# EAGLE design peacock3 (EAGLE 6.5.0)
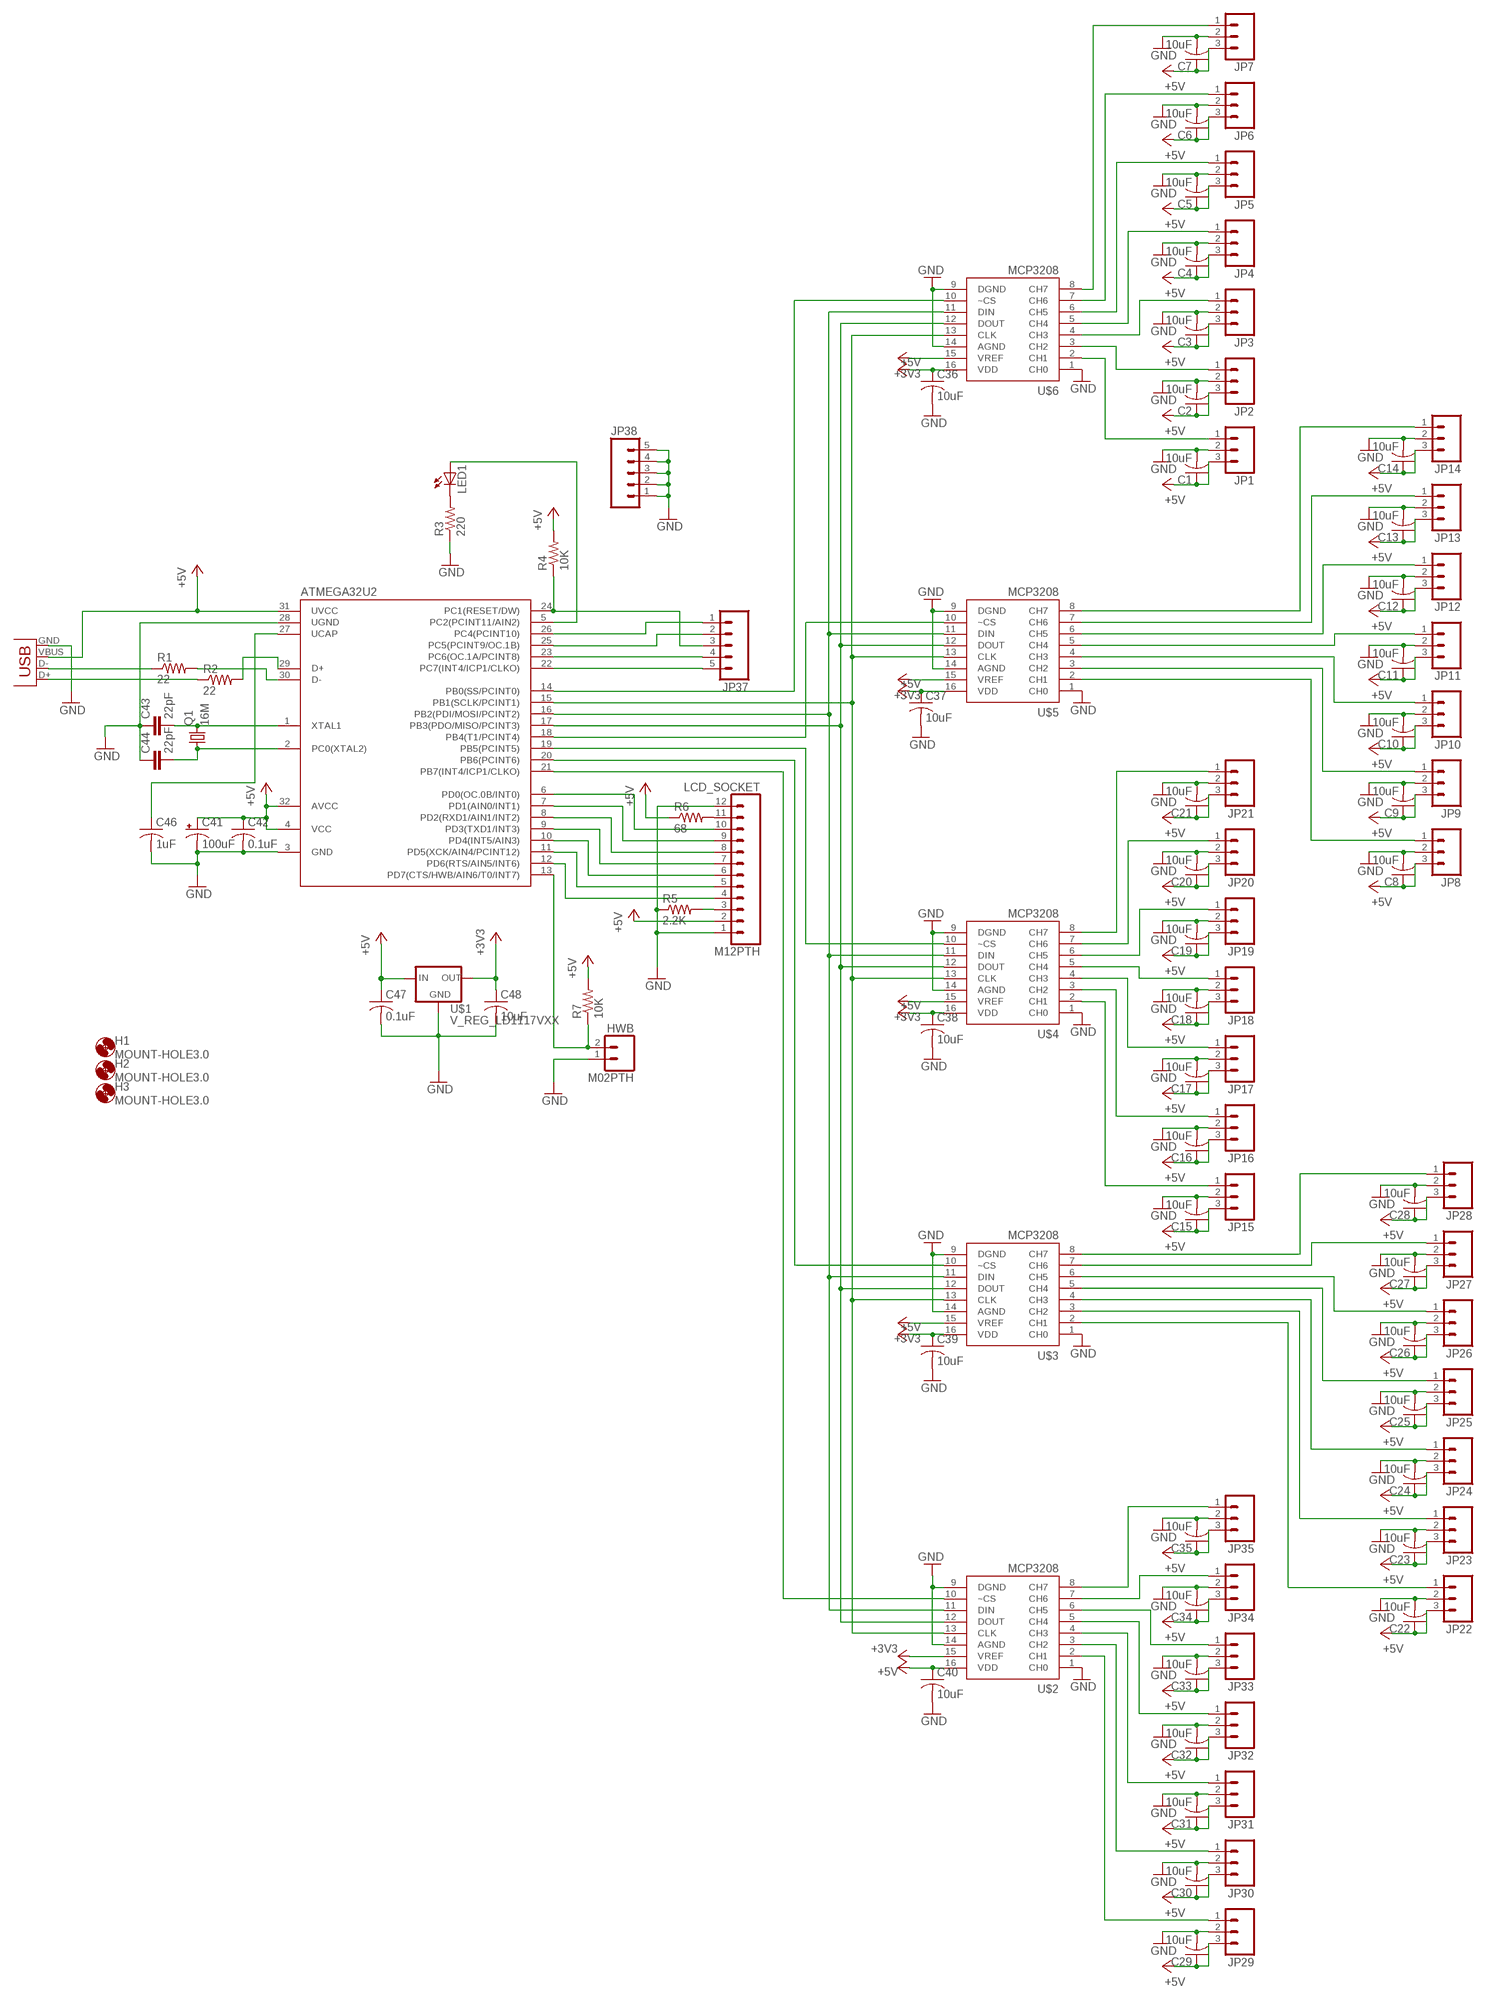
[diagram p0: schematic, sheet 1]

## Parts
ATMEGA32U2  ATMEGA32U2  [TQFP32-08]
C1  10uF  C-USC1210  [C1210]
C2  10uF  C-USC1210  [C1210]
C3  10uF  C-USC1210  [C1210]
C4  10uF  C-USC1210  [C1210]
C5  10uF  C-USC1210  [C1210]
C6  10uF  C-USC1210  [C1210]
C7  10uF  C-USC1210  [C1210]
C8  10uF  C-USC1210  [C1210]
C9  10uF  C-USC1210  [C1210]
C10  10uF  C-USC1210  [C1210]
C11  10uF  C-USC1210  [C1210]
C12  10uF  C-USC1210  [C1210]
C13  10uF  C-USC1210  [C1210]
C14  10uF  C-USC1210  [C1210]
C15  10uF  C-USC1210  [C1210]
C16  10uF  C-USC1210  [C1210]
C17  10uF  C-USC1210  [C1210]
C18  10uF  C-USC1210  [C1210]
C19  10uF  C-USC1210  [C1210]
C20  10uF  C-USC1210  [C1210]
C21  10uF  C-USC1210  [C1210]
C22  10uF  C-USC1210  [C1210]
C23  10uF  C-USC1210  [C1210]
C24  10uF  C-USC1210  [C1210]
C25  10uF  C-USC1210  [C1210]
C26  10uF  C-USC1210  [C1210]
C27  10uF  C-USC1210  [C1210]
C28  10uF  C-USC1210  [C1210]
C29  10uF  C-USC1210  [C1210]
C30  10uF  C-USC1210  [C1210]
C31  10uF  C-USC1210  [C1210]
C32  10uF  C-USC1210  [C1210]
C33  10uF  C-USC1210  [C1210]
C34  10uF  C-USC1210  [C1210]
C35  10uF  C-USC1210  [C1210]
C36  10uF  C-USC1210  [C1210]
C37  10uF  C-USC1210  [C1210]
C38  10uF  C-USC1210  [C1210]
C39  10uF  C-USC1210  [C1210]
C40  10uF  C-USC1210  [C1210]
C41  100uF  CPOL-USE5-6  [E5-6]
C42  0.1uF  C-USC1210  [C1210]
C43  22pF  C-EU050-024X044  [C050-024X044]
C44  22pF  C-EU050-024X044  [C050-024X044]
C46  1uF  C-USC1210  [C1210]
C47  0.1uF  C-USC1210  [C1210]
C48  10uF  C-USC1210  [C1210]
H1  MOUNT-HOLE3.0  [3,0]
H2  MOUNT-HOLE3.0  [3,0]
H3  MOUNT-HOLE3.0  [3,0]
HWB  M02PTH  [1X02]
JP1  M03PTH  [1X03]
JP2  M03PTH  [1X03]
JP3  M03PTH  [1X03]
JP4  M03PTH  [1X03]
JP5  M03PTH  [1X03]
JP6  M03PTH  [1X03]
JP7  M03PTH  [1X03]
JP8  M03PTH  [1X03]
JP9  M03PTH  [1X03]
JP10  M03PTH  [1X03]
JP11  M03PTH  [1X03]
JP12  M03PTH  [1X03]
JP13  M03PTH  [1X03]
JP14  M03PTH  [1X03]
JP15  M03PTH  [1X03]
JP16  M03PTH  [1X03]
JP17  M03PTH  [1X03]
JP18  M03PTH  [1X03]
JP19  M03PTH  [1X03]
JP20  M03PTH  [1X03]
JP21  M03PTH  [1X03]
JP22  M03PTH  [1X03]
JP23  M03PTH  [1X03]
JP24  M03PTH  [1X03]
JP25  M03PTH  [1X03]
JP26  M03PTH  [1X03]
JP27  M03PTH  [1X03]
JP28  M03PTH  [1X03]
JP29  M03PTH  [1X03]
JP30  M03PTH  [1X03]
JP31  M03PTH  [1X03]
JP32  M03PTH  [1X03]
JP33  M03PTH  [1X03]
JP34  M03PTH  [1X03]
JP35  M03PTH  [1X03]
JP36  USB-B  USBPTH  [USB-B-PTH]
JP37  M05PTH  [1X05]
JP38  M05PTH  [1X05]
LCD_SOCKET  M12PTH  [1X12]
LED1  LED5MM  [LED5MM]
Q1  16M  CRYSTALHC18U-V  [HC18U-V]
R1  22  R-US_0204/7  [0204/7]
R2  22  R-US_0204/7  [0204/7]
R3  220  R-US_0204/7  [0204/7]
R4  10K  R-US_0204/7  [0204/7]
R5  2.2K  R-US_0204/7  [0204/7]
R6  68  R-US_0204/7  [0204/7]
R7  10K  R-US_0204/7  [0204/7]
U$1  V_REG_LD1117VXX  [78XXL]
U$2  MCP3208  [SO16]
U$3  MCP3208  [SO16]
U$4  MCP3208  [SO16]
U$5  MCP3208  [SO16]
U$6  MCP3208  [SO16]

## Nets
+3V3: C48.1 U$1.GND(OUT) U$2.15(VREF) U$3.15(VREF) U$4.15(VREF) U$5.15(VREF) U$6.15(VREF)
+5V: ATMEGA32U2.4(VCC) ATMEGA32U2.31(UVCC) ATMEGA32U2.32(AVCC) C1.1 C2.1 C3.1 C4.1 C5.1 C6.1 C7.1 C8.1 C9.1 C10.1 C11.1 C12.1 C13.1 C14.1 C15.1 C16.1 C17.1 C18.1 C19.1 C20.1 C21.1 C22.1 C23.1 C24.1 C25.1 C26.1 C27.1 C28.1 C29.1 C30.1 C31.1 C32.1 C33.1 C34.1 C35.1 C36.1 C37.1 C38.1 C39.1 C40.1 C41.+ C42.1 C47.1 JP1.3 JP2.3 JP3.3 JP4.3 JP5.3 JP6.3 JP7.3 JP8.3 JP9.3 JP10.3 JP11.3 JP12.3 JP13.3 JP14.3 JP15.3 JP16.3 JP17.3 JP18.3 JP19.3 JP20.3 JP21.3 JP22.3 JP23.3 JP24.3 JP25.3 JP26.3 JP27.3 JP28.3 JP29.3 JP30.3 JP31.3 JP32.3 JP33.3 JP34.3 JP35.3 JP36.VBUS LCD_SOCKET.2 R4.2 R6.1 R7.2 U$1.OUT(IN) U$2.16(VDD) U$3.16(VDD) U$4.16(VDD) U$5.16(VDD) U$6.16(VDD)
BIT0: ATMEGA32U2.9(PD3(TXD1/INT3)) LCD_SOCKET.7
BIT1: ATMEGA32U2.8(PD2(RXD1/AIN1/INT2)) LCD_SOCKET.8
BIT2: ATMEGA32U2.7(PD1(AIN0/INT1)) LCD_SOCKET.9
BIT3: ATMEGA32U2.6(PD0(OC.0B/INT0)) LCD_SOCKET.10
CLK: ATMEGA32U2.15(PB1(SCLK/PCINT1)) U$2.13(CLK) U$3.13(CLK) U$4.13(CLK) U$5.13(CLK) U$6.13(CLK)
ENABLE: ATMEGA32U2.10(PD4(INT5/AIN3)) LCD_SOCKET.6
GND: ATMEGA32U2.3(GND) ATMEGA32U2.28(UGND) C1.2 C2.2 C3.2 C4.2 C5.2 C6.2 C7.2 C8.2 C9.2 C10.2 C11.2 C12.2 C13.2 C14.2 C15.2 C16.2 C17.2 C18.2 C19.2 C20.2 C21.2 C22.2 C23.2 C24.2 C25.2 C26.2 C27.2 C28.2 C29.2 C30.2 C31.2 C32.2 C33.2 C34.2 C35.2 C36.2 C37.2 C38.2 C39.2 C40.2 C41.- C42.2 C43.1 C44.1 C46.2 C47.2 C48.2 HWB.1 JP1.2 JP2.2 JP3.2 JP4.2 JP5.2 JP6.2 JP7.2 JP8.2 JP9.2 JP10.2 JP11.2 JP12.2 JP13.2 JP14.2 JP15.2 JP16.2 JP17.2 JP18.2 JP19.2 JP20.2 JP21.2 JP22.2 JP23.2 JP24.2 JP25.2 JP26.2 JP27.2 JP28.2 JP29.2 JP30.2 JP31.2 JP32.2 JP33.2 JP34.2 JP35.2 JP36.GND JP38.1 JP38.2 JP38.3 JP38.4 JP38.5 LCD_SOCKET.1 LCD_SOCKET.12 R3.1 R5.1 U$1.IN(GND) U$2.1(CH0) U$2.9(DGND) U$2.14(AGND) U$3.1(CH0) U$3.9(DGND) U$3.14(AGND) U$4.1(CH0) U$4.9(DGND) U$4.14(AGND) U$5.1(CH0) U$5.9(DGND) U$5.14(AGND) U$6.1(CH0) U$6.9(DGND) U$6.14(AGND)
HWB: ATMEGA32U2.13(PD7(CTS/HWB/AIN6/T0/INT7)) HWB.2 R7.1
MISO: ATMEGA32U2.17(PB3(PDO/MISO/PCINT3)) U$2.12(DOUT) U$3.12(DOUT) U$4.12(DOUT) U$5.12(DOUT) U$6.12(DOUT)
MOSI: ATMEGA32U2.16(PB2(PDI/MOSI/PCINT2)) U$2.11(DIN) U$3.11(DIN) U$4.11(DIN) U$5.11(DIN) U$6.11(DIN)
N$1: ATMEGA32U2.5(PC2(PCINT11/AIN2)) LED1.A
N$2: JP15.1 U$4.2(CH1)
N$3: JP16.1 U$4.3(CH2)
N$4: JP17.1 U$4.4(CH3)
N$5: JP18.1 U$4.5(CH4)
N$6: JP19.1 U$4.6(CH5)
N$7: ATMEGA32U2.30(D-) R1.2
N$8: ATMEGA32U2.2(PC0(XTAL2)) C44.2 Q1.1
N$9: ATMEGA32U2.1(XTAL1) C43.2 Q1.2
N$11: JP20.1 U$4.7(CH6)
N$12: JP21.1 U$4.8(CH7)
N$13: JP1.1 U$6.2(CH1)
N$14: ATMEGA32U2.29(D+) R2.2
N$15: JP36.D+ R2.1
N$16: JP36.D- R1.1
N$17: JP2.1 U$6.3(CH2)
N$19: LED1.K(C) R3.2
N$20: ATMEGA32U2.26(PC4(PCINT10)) JP37.1
N$22: ATMEGA32U2.25(PC5(PCINT9/OC.1B)) JP37.2
N$24: LCD_SOCKET.3 R5.2
N$25: JP3.1 U$6.4(CH3)
N$26: ATMEGA32U2.23(PC6(OC.1A/PCINT8)) JP37.4
N$27: LCD_SOCKET.11 R6.2
N$28: ATMEGA32U2.27(UCAP) C46.1
N$29: JP4.1 U$6.5(CH4)
N$30: JP5.1 U$6.6(CH5)
N$32: JP27.1 U$3.7(CH6)
N$33: JP28.1 U$3.8(CH7)
N$34: JP35.1 U$2.8(CH7)
N$35: JP34.1 U$2.7(CH6)
N$36: JP6.1 U$6.7(CH6)
N$38: JP7.1 U$6.8(CH7)
N$39: ATMEGA32U2.14(PB0(SS/PCINT0)) U$6.10(~CS)
N$40: ATMEGA32U2.21(PB7(INT4/ICP1/CLKO)) U$2.10(~CS)
N$41: JP14.1 U$5.8(CH7)
N$42: JP13.1 U$5.7(CH6)
N$43: JP12.1 U$5.6(CH5)
N$44: ATMEGA32U2.20(PB6(PCINT6)) U$3.10(~CS)
N$45: JP11.1 U$5.5(CH4)
N$46: JP10.1 U$5.4(CH3)
N$47: ATMEGA32U2.18(PB4(T1/PCINT4)) U$5.10(~CS)
N$48: ATMEGA32U2.19(PB5(PCINT5)) U$4.10(~CS)
N$50: JP9.1 U$5.3(CH2)
N$51: JP8.1 U$5.2(CH1)
N$52: JP25.1 U$3.5(CH4)
N$54: JP24.1 U$3.4(CH3)
N$55: JP23.1 U$3.3(CH2)
N$59: ATMEGA32U2.22(PC7(INT4/ICP1/CLKO)) JP37.5
N$60: JP22.1 U$3.2(CH1)
N$61: JP33.1 U$2.6(CH5)
N$62: JP32.1 U$2.5(CH4)
N$63: JP31.1 U$2.4(CH3)
N$64: JP30.1 U$2.3(CH2)
N$65: JP29.1 U$2.2(CH1)
N$66: JP26.1 U$3.6(CH5)
RESET: ATMEGA32U2.24(PC1(RESET/DW)) JP37.3 R4.1
RS: ATMEGA32U2.12(PD6(RTS/AIN5/INT6)) LCD_SOCKET.4
RW: ATMEGA32U2.11(PD5(XCK/AIN4/PCINT12)) LCD_SOCKET.5

## Library data of the parts
ATMEGA32U2 = CEDT:ATMEGA32U2
C1-C40 C42 C46-C48 = resistor:C-US: CAPACITOR, American symbol
C41 = resistor:CPOL-US: POLARIZED CAPACITOR, American symbol
C43 C44 = resistor:C-EU: CAPACITOR, European symbol
H1-H3 = holes:MOUNT-HOLE: MOUNTING HOLE with drill center marker
HWB = SparkFun-Connectors:M02: Standard 2-pin 0.1" header. Use with - straight break away headers ( PRT-00116) - right angle break away headers (PRT-00553) - swiss pins (PRT-00743) - machine pins (PRT-00117) - female headers (PRT-00115) Molex polarized connector foot print use with: PRT-08233 with associated crimp pins and housings. 2.54_SCREWTERM for use with PRT-10571. 3.5mm Screw Terminal footprints for PRT-08084 5mm Screw Terminal footprints for use with PRT-08433
JP1-JP35 = SparkFun-Connectors:M03: Header 3 Standard 3-pin 0.1" header. Use with straight break away headers (SKU : PRT-00116), right angle break away headers (PRT-00553), swiss pins (PRT-00743), machine pins (PRT-00117), and female headers (PRT-00115). Molex polarized connector foot print use with SKU : PRT-08232 with associated crimp pins and housings.
JP36 = SparkFun-Connectors:USB: USB Connectors USB-B-PTH is fully proven SKU : PRT-00139/CONN-08278 USB-miniB is fully proven SKU : PRT-00587 USB-A-PCB is untested. USB-A-H is throughly reviewed, but untested. Spark Fun Electronics SKU : PRT-00437 USB-B-SMT is throughly reviewed, but untested. Needs silkscreen touching up. USB-A-S has not been used/tested USB-MB-H has not been used/tested USB-MICROB has been used. CONN-09505; PROD_ID: CONN-08278
JP37 JP38 = SparkFun-Connectors:M05: Header 5 Standard 5-pin 0.1" header. Use with straight break away headers (SKU : PRT-00116), right angle break away headers (PRT-00553), swiss pins (PRT-00743), machine pins (PRT-00117), and female headers (PRT-00115). Molex polarized connector foot print use with SKU : PRT-08230 with associated crimp pins and housings.
LCD_SOCKET = SparkFun-Connectors:M12: Header 12 Standard 12-pin 0.1" header. Use with straight break away headers (SKU : PRT-00116), right angle break away headers (PRT-00553), swiss pins (PRT-00743), machine pins (PRT-00117), and female headers (PRT-00115).
LED1 = led:LED: LED OSRAM: - CHIPLED LG R971, LG N971, LY N971, LG Q971, LY Q971, LO R971, LY R971 LH N974, LH R974 LS Q976, LO Q976, LY Q976 LO Q996 - Hyper CHIPLED LW Q18S LB Q993, LB Q99A, LB R99A - SideLED LS A670, LO A670, LY A670, LG A670, LP A670 LB A673, LV A673, LT A673, LW A673 LH A674 LY A675 LS A676, LA A676, LO A676, LY A676, LW A676 LS A679, LY A679, LG A679 - Hyper Micro SIDELED® LS Y876, LA Y876, LO Y876, LY Y876 LT Y87S - SmartLED LW L88C, LW L88S LB L89C, LB L89S, LG L890 LS L89K, LO L89K, LY L89K LS L896, LA L896, LO L896, LY L896 - TOPLED LS T670, LO T670, LY T670, LG T670, LP T670 LSG T670, LSP T670, LSY T670, LOP T670, LYG T670 LG T671, LOG T671, LSG T671 LB T673, LV T673, LT T673, LW T673 LH T674 LS T676, LA T676, LO T676, LY T676, LB T676, LH T676, LSB T676, LW T676 LB T67C, LV T67C, LT T67C, LS T67K, LO T67K, LY T67K, LW E67C LS E67B, LA E67B, LO E67B, LY E67B, LB E67C, LV E67C, LT E67C LW T67C LS T679, LY T679, LG T679 LS T770, LO T770, LY T770, LG T770, LP T770 LB T773, LV T773, LT T773, LW T773 LH T774 LS E675, LA E675, LY E675, LS T675 LS T776, LA T776, LO T776, LY T776, LB T776 LHGB T686 LT T68C, LB T68C - Hyper Mini TOPLED® LB M676 - Mini TOPLED Santana® LG M470 LS M47K, LO M47K, LY M47K Source: http://www.osram.convergy.de LUXEON: - LUMILED® LXK2-PW12-R00, LXK2-PW12-S00, LXK2-PW14-U00, LXK2-PW14-V00 LXK2-PM12-R00, LXK2-PM12-S00, LXK2-PM14-U00 LXK2-PE12-Q00, LXK2-PE12-R00, LXK2-PE12-S00, LXK2-PE14-T00, LXK2-PE14-U00 LXK2-PB12-K00, LXK2-PB12-L00, LXK2-PB12-M00, LXK2-PB14-N00, LXK2-PB14-P00, LXK2-PB14-Q00 LXK2-PR12-L00, LXK2-PR12-M00, LXK2-PR14-Q00, LXK2-PR14-R00 LXK2-PD12-Q00, LXK2-PD12-R00, LXK2-PD12-S00 LXK2-PH12-R00, LXK2-PH12-S00 LXK2-PL12-P00, LXK2-PL12-Q00, LXK2-PL12-R00 Source: www.luxeon.com KINGBRIGHT: KA-3528ASYC Source: www.kingbright.com
Q1 = crystal:CRYSTAL: CRYSTAL; OC_FARNELL: unknown; OC_NEWARK: unknown
R1-R7 = resistor:R-US_: RESISTOR, American symbol
U$1 = myLibrary:V_REG_LD1117VXX: LD1117VXX voltage regulator. We carry the 3.3V version (COM-00526) in TO-220 package.
U$2-U$6 = mcp3208:MCP3208

## Board
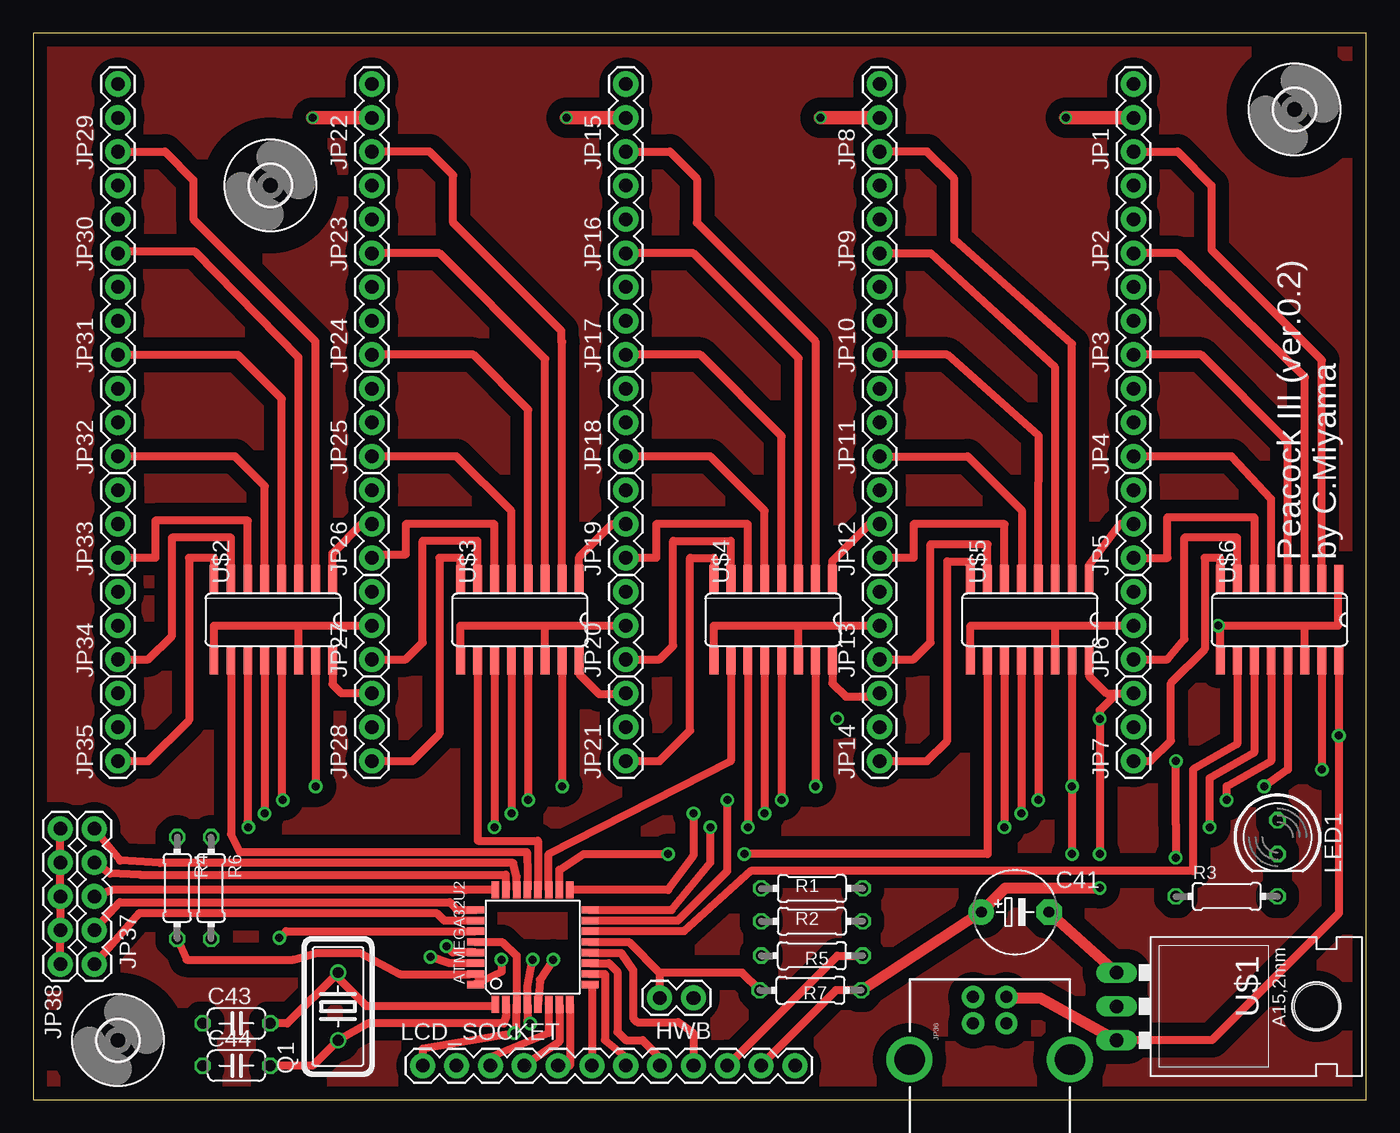
[diagram p1: board, top side]
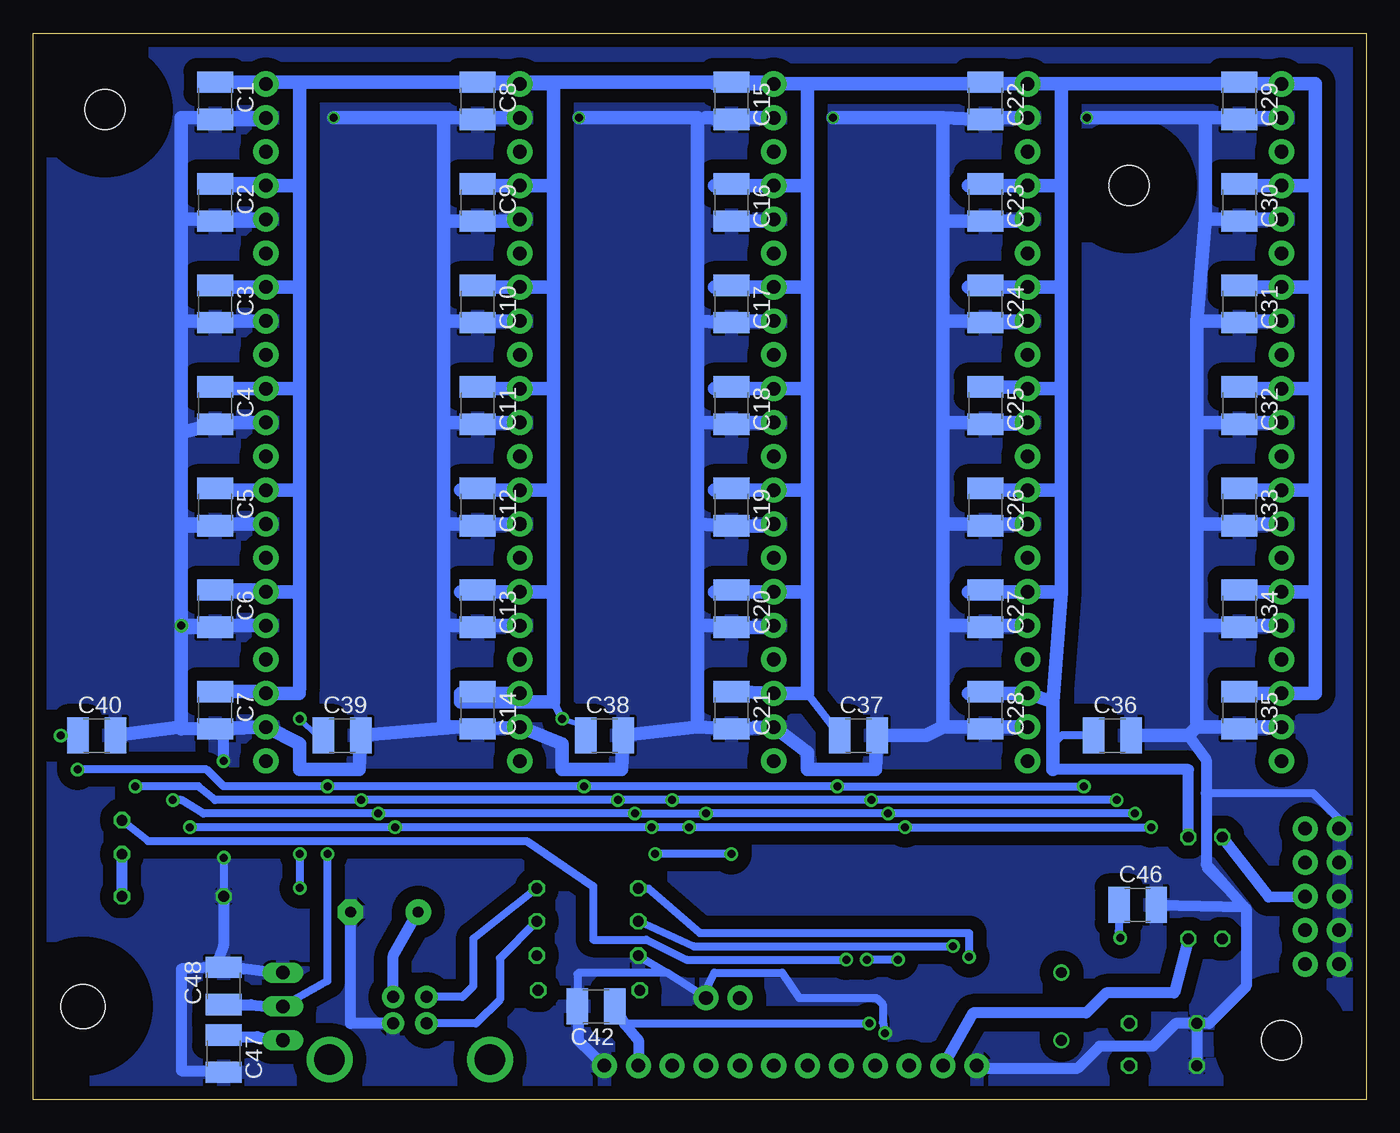
[diagram p2: board, bottom side, seen from below]

Size 100 x 80 mm. Coordinates in mm from the lower left corner, seen from the top.
Outline: 0,0 100,0 100,80 0,80 0,0
Copper layers (1*16): Top 0.018mm / dielectric 1.55mm / Bottom 0.018mm
Design rules "eC_2Layer_PClass6_BaseCopperO18_eCDefault": minimum track width 0.15mm, minimum drill 0.35mm, track to track 0.15mm, track to pad 0.15mm, pad to pad 0.15mm, via to via 0.15mm, smd to smd 0mil, copper to edge 0.25mm, drill to drill 0.35mm, minimum pad ring 0.175mm, minimum via ring 0.125mm, stop-mask expansion 0mil, vias tented up to drill 0.45mm, thermal gap 0.2mm

### Footprints (pad centres in the part's own frame; a part is rotated, then mirrored left to right if it is on the bottom)
TQFP32-08 = smd 1.27 x 0.559: 1 -4.293,2.8; 2 -4.293,2; 3 -4.293,1.2; 4 -4.293,0.4; 5 -4.293,-0.4; 6 -4.293,-1.2; 7 -4.293,-2; 8 -4.293,-2.8; 17 4.293,-2.8; 18 4.293,-2; 19 4.293,-1.2; 20 4.293,-0.4; 21 4.293,0.4; 22 4.293,1.2; 23 4.293,2; 24 4.293,2.8 | smd 0.559 x 1.27: 9 -2.8,-4.293; 10 -2,-4.293; 11 -1.2,-4.293; 12 -0.4,-4.293; 13 0.4,-4.293; 14 1.2,-4.293; 15 2,-4.293; 16 2.8,-4.293; 25 2.8,4.293; 26 2,4.293; 27 1.2,4.293; 28 0.4,4.293; 29 -0.4,4.293; 30 -1.2,4.293; 31 -2,4.293; 32 -2.8,4.293
C1210 = smd 1.6 x 2.7: 1 -1.4,0; 2 1.4,0
E5-6 = drill 0.813 pad 1.905: + -2.54,0 | drill 0.813 pad 1.905 octagon: - 2.54,0
C050-024X044 = drill 0.813 octagon: 1 -2.54,0; 2 2.54,0
3,0 = hole 3: 0,0
1X02 = drill 1.016 pad 1.88: 1 0,0; 2 2.54,0
1X03 = drill 1.016 pad 1.88: 1 0,0; 2 2.54,0; 3 5.08,0
USB-B-PTH = drill 0.914 pad 1.676: D+ 0,1.25; D- 1.981,1.25; GND 0,-1.25; VBUS 1.981,-1.25 | drill 2.286: S1 -2.718,-6.02; S2 -2.718,6.02
1X05 = drill 1.016 pad 1.88: 1 0,0; 2 2.54,0; 3 5.08,0; 4 7.62,0; 5 10.16,0
1X12 = drill 1.016 pad 1.88: 1 0,0; 2 2.54,0; 3 5.08,0; 4 7.62,0; 5 10.16,0; 6 12.7,0; 7 15.24,0; 8 17.78,0; 9 20.32,0; 10 22.86,0; 11 25.4,0; 12 27.94,0
LED5MM = drill 0.813 octagon: A -1.27,0; K 1.27,0
HC18U-V = drill 0.813: 1 -2.54,0; 2 2.54,0
0204/7 = drill 0.813 octagon: 1 -3.81,0; 2 3.81,0
78XXL = drill 1.016 long: GND 0,-3.81; IN -2.54,-3.81; OUT 2.54,-3.81 | hole 3.302: 0,11.176
SO16 = smd 0.66 x 2.032: 1 -4.445,-3.073; 2 -3.175,-3.073; 3 -1.905,-3.073; 4 -0.635,-3.073; 5 0.635,-3.073; 6 1.905,-3.073; 7 3.175,-3.073; 8 4.445,-3.073; 9 4.445,3.073; 10 3.175,3.073; 11 1.905,3.073; 12 0.635,3.073; 13 -0.635,3.073; 14 -1.905,3.073; 15 -3.175,3.073; 16 -4.445,3.073

### Placement (x,y rotation side)
ATMEGA32U2  37.47,11.43 90 top
C1  86.36,74.93 270 bottom
C2  86.36,67.31 270 bottom
C3  86.36,59.69 270 bottom
C4  86.36,52.07 270 bottom
C5  86.36,44.45 270 bottom
C6  86.36,36.83 270 bottom
C7  86.36,29.21 270 bottom
C8  66.67,74.93 270 bottom
C9  66.67,67.31 270 bottom
C10  66.67,59.69 270 bottom
C11  66.67,52.07 270 bottom
C12  66.67,44.45 270 bottom
C13  66.67,36.83 270 bottom
C14  66.67,29.21 270 bottom
C15  47.62,74.93 270 bottom
C16  47.62,67.31 270 bottom
C17  47.62,59.69 270 bottom
C18  47.62,52.07 270 bottom
C19  47.62,44.45 270 bottom
C20  47.62,36.83 270 bottom
C21  47.62,29.21 270 bottom
C22  28.57,74.93 270 bottom
C23  28.57,67.31 270 bottom
C24  28.57,59.69 270 bottom
C25  28.57,52.07 270 bottom
C26  28.57,44.45 270 bottom
C27  28.57,36.83 270 bottom
C28  28.57,29.21 270 bottom
C29  9.53,74.93 270 bottom
C30  9.53,67.31 270 bottom
C31  9.53,59.69 270 bottom
C32  9.53,52.07 270 bottom
C33  9.53,44.45 270 bottom
C34  9.53,36.83 270 bottom
C35  9.53,29.21 270 bottom
C36  19.05,27.3 0 bottom
C37  38.1,27.3 0 bottom
C38  57.15,27.3 0 bottom
C39  76.83,27.3 0 bottom
C40  95.25,27.3 0 bottom
C41  73.66,14.06 0 top
C42  57.78,6.99 180 bottom
C43  15.24,5.71 0 top
C44  15.24,2.54 0 top
C46  17.14,14.61 0 bottom
C47  85.72,3.44 270 bottom
C48  85.72,8.53 90 bottom
H1  17.78,68.58 0 top
H2  6.35,4.45 0 top
H3  94.61,74.3 0 top
HWB  49.53,7.62 180 top
JP1  82.55,71.12 90 top
JP2  82.55,63.5 90 top
JP3  82.55,55.88 90 top
JP4  82.55,48.26 90 top
JP5  82.55,40.64 90 top
JP6  82.55,33.02 90 top
JP7  82.55,25.4 90 top
JP8  63.5,71.12 90 top
JP9  63.5,63.5 90 top
JP10  63.5,55.88 90 top
JP11  63.5,48.26 90 top
JP12  63.5,40.64 90 top
JP13  63.5,33.02 90 top
JP14  63.5,25.4 90 top
JP15  44.45,71.12 90 top
JP16  44.45,63.5 90 top
JP17  44.45,55.88 90 top
JP18  44.45,48.26 90 top
JP19  44.45,40.64 90 top
JP20  44.45,33.02 90 top
JP21  44.45,25.4 90 top
JP22  25.4,71.12 90 top
JP23  25.4,63.5 90 top
JP24  25.4,55.88 90 top
JP25  25.4,48.26 90 top
JP26  25.4,40.64 90 top
JP27  25.4,33.02 90 top
JP28  25.4,25.4 90 top
JP29  6.35,71.12 90 top
JP30  6.35,63.5 90 top
JP31  6.35,55.88 90 top
JP32  6.35,48.26 90 top
JP33  6.35,40.64 90 top
JP34  6.35,33.02 90 top
JP35  6.35,25.4 90 top
JP36  71.75,5.71 90 top
JP37  4.57,10.16 90 top
JP38  2.03,20.32 270 top
LCD_SOCKET  57.15,2.54 180 top
LED1  93.34,19.68 270 top
Q1  22.86,6.99 90 top
R1  58.42,15.84 180 top
R2  58.42,13.38 180 top
R3  89.53,15.24 0 top
R4  10.79,15.88 270 top
R5  58.42,10.79 0 top
R6  13.34,15.88 270 top
R7  58.31,8.2 0 top
U$1  85.09,6.99 270 top
U$2  18,36 180 top
U$3  36.5,36 180 top
U$4  55.51,36 180 top
U$5  74.76,36 180 top
U$6  93.5,36 180 top

### Tracks (layer width: path | path; a pad name or v marks a point on that pad's centre or on a via)
+3V3  (via drill 0.6 pad 1.02)
  Top 0.61: v77.94,18.41 v77.94,23.5 U$5.15 | U$2.15 21.18,23.71 v21.18,23.5 | U$3.15 v39.67,23.5 | U$4.15 v58.68,23.5 | U$6.15 v96.67,24.77
  Bottom 0.61: v21.18,23.5 v39.67,23.5 v58.68,23.5 v77.94,23.5 85.72,23.5 87,24.77 v96.67,24.77 | v77.94,18.41 77.94,8.89 U$1.GND
  Bottom 0.813: C48.1 83.69,7.12 82.55,6.99 U$1.GND
+5V  (via drill 0.6 pad 1.02)
  Top 0.406: JP7.3 81.28,30.48
  Top 0.61: 81.28,30.48 80.01,29.21 v80.01,28.57 v80.01,18.41 | v35.12,10.49 35.16,9.59 ATMEGA32U2.32 33.17,8.67 33.5,9 33.5,9.1 ATMEGA32U2.31 32.74,9.4 27.5,9.4 24.5,11 21.25,11 19.5,10.5 11.5,10.5 R4.2 | v37.47,10.49 37.06,8.49 ATMEGA32U2.4 37.06,5.93 v37.28,5.71 | U$2.16 22.45,31.15 23.11,30.48 JP28.3 | U$6.16 v97.94,27.3 97.94,13.97 88.42,4.45 U$1.OUT | U$3.16 40.95,31.95 42.46,30.43 44.4,30.43 JP21.3 | U$5.16 79.21,31.79 80.52,30.48 JP7.3 | U$4.16 59.95,31.23 60.96,30.23 63.25,30.23 JP14.3 | R7.2 60.2,8.2 55,3
  Top 0.813: v80.01,15.88 72.93,15.88 C41.+ R7.2 | JP36.VBUS 73.08,7.62 75.56,7.62 U$1.OUT | 55,3 55,2.93 LCD_SOCKET.2
  Bottom 0.406: v60.33,28.57 58.42,27.94 58.42,27.3 C38.1 | v80.01,28.57 78.74,27.3 C39.1 | v97.94,27.3 C40.1
  Bottom 0.61: v80.01,18.41 v80.01,15.88 | 55.66,5.71 v37.28,5.71 | v35.12,10.49 v37.47,10.49 | C36.1 22.86,27.3 23.5,26.67 | C37.1 41.91,30.48 44.7,30.23 | 60.96,29.84 v60.33,28.57
  Bottom 0.813: 63.5,68.71 JP9.3 | 63.5,61.09 JP10.3 | 25.4,76.33 JP22.3 | 25.4,68.71 JP23.3 | 44.45,68.71 JP16.3 | 44.45,61.09 JP17.3 | 44.45,53.47 JP18.3 | C42.1 55.66,5.71 54.61,4.45 LCD_SOCKET.2 | JP36.VBUS 73,10.79 C41.+ | C47.1 85.59,4.71 83.19,4.71 81.92,4.45 U$1.OUT | 23.5,24.77 13.34,24.77 R6.1
  Bottom 1.016: 82.55,76.33 C1.1 | JP2.3 82.55,68.71 C2.1 86.36,68.58 JP2.3 | C3.1 86.36,60.96 JP3.3 80.01,60.96 | C5.1 86.36,45.72 JP5.3 80.01,45.72 | JP6.3 82.55,38.23 C6.1 86.36,38.1 80.01,38.1 | C7.1 82.55,30.61 JP7.3 80.07,30.48 80.07,30.86 80.01,30.86 80.01,38.1 | C8.1 67.31,76.2 JP8.3 60.96,76.2 60.96,68.58 | C9.1 67.31,68.58 JP9.3 60.96,68.58 | C10.1 67.31,60.96 JP10.3 60.96,60.96 | C11.1 67.31,53.34 JP11.3 60.96,53.34 | C12.1 67.94,45.72 JP12.3 | JP13.3 67.94,38.1 C13.1 66.67,38.1 60.96,38.1 | C14.1 67.94,30.48 | 67.94,30.48 JP14.3 | 48.9,38.1 C20.1 47.62,38.1 JP20.3 | C19.1 48.9,45.72 JP19.3 41.91,45.72 | C18.1 48.9,53.34 JP18.3 41.91,53.34 | C17.1 48.9,60.96 JP17.3 41.91,60.96 | C16.1 48.9,68.58 JP16.3 41.91,68.58 | C15.1 48.9,76.2 | JP22.3 27.94,76.2 27.94,76.33 C22.1 28.57,76.2 JP15.3 | C23.1 29.84,68.58 JP23.3 22.86,68.58 | C24.1 29.84,60.96 JP24.3 22.86,60.96 | C25.1 25.4,53.47 JP25.3 22.86,53.34 | 29.84,38.1 C27.1 28.57,38.1 JP27.3 22.86,38.1 | C28.1 29.84,30.48 JP28.3 23.5,29.84 | C29.1 10.16,76.2 | 10.16,76.2 JP29.3 3.81,76.2 3.81,68.58 | C30.1 10.16,68.58 JP30.3 3.81,68.58 | C31.1 10.16,60.96 JP31.3 | C32.1 10.16,53.34 JP32.3 3.81,53.34 | 9.53,45.72 10.16,45.72 C33.1 9.53,45.72 | 9.53,45.72 JP33.3 3.81,45.72 | JP34.3 10.16,38.1 C34.1 9.53,38.1 3.81,38.1 | 9.53,30.48 10.16,30.48 C35.1 9.53,30.48 | 9.53,30.48 JP35.3 3.81,30.48 3.81,38.1 | 6.35,61.09 JP31.3 | JP31.3 3.81,60.96 | 3.81,60.96 3.81,68.58 | 3.81,60.96 3.81,53.34 | 3.81,45.72 3.81,53.34 | 3.81,38.1 3.81,45.72 | JP22.3 22.86,76.2 22.86,68.58 | 22.86,60.96 22.86,68.58 | 22.86,53.34 22.86,60.96 | C26.1 28.57,45.72 JP26.3 22.86,45.72 | 22.86,45.72 22.86,53.34
  Bottom 1.016: 22.86,38.1 22.86,45.72 | 23.5,24.77 23.5,26.67 23.5,29.84 | 23.5,29.84 22.86,38.1 | JP15.3 41.91,76.2 41.91,68.58 | 41.91,68.58 41.91,60.96 | 41.91,60.96 41.91,53.34 | 41.91,45.72 41.91,53.34 | 44.45,38.23 JP20.3 | JP20.3 41.91,38.1 | 41.91,38.1 41.91,45.72 | 41.91,38.1 41.91,30.48 JP21.3 C21.1 | 60.96,60.96 60.96,68.58 | 60.96,53.34 60.96,60.96 | 63.5,45.85 JP12.3 | JP12.3 60.96,45.72 | 60.96,45.72 60.96,53.34 | 60.96,38.1 60.96,45.72 | 67.94,30.48 67.94,29.84 60.96,29.84 60.96,38.1 | 80.01,76.33 80.01,68.58 | 80.01,68.58 JP2.3 | 80.01,68.58 80.01,60.96 | 80.01,60.96 80.01,53.34 | 80.01,53.34 JP4.3 86.36,53.34 C4.1 | 80.01,53.34 80.01,45.72 | 80.01,38.1 80.01,45.72 | JP22.3 10.16,76.2 | JP15.3 44.45,76.33 C15.1 | C15.1 C8.1 | C15.1 47.62,76.2 JP15.3 | JP1.3 82.55,76.33 | 80.01,76.33 C8.1 | 80.01,76.33 82.55,76.33
BIT0
  Top 0.406: ATMEGA32U2.9 41.91,8.63
  Top 0.61: 41.91,8.63 LCD_SOCKET.7
BIT1
  Top 0.61: ATMEGA32U2.8 40.27,2.54 LCD_SOCKET.8
BIT2
  Top 0.61: ATMEGA32U2.7 39.47,4.34 LCD_SOCKET.9
BIT3
  Top 0.406: ATMEGA32U2.6 38.66,7.07
  Top 0.61: 38.66,7.07 38.66,4.98 34.29,3.17 LCD_SOCKET.10
CLK  (via drill 0.6 pad 1.02)
  Top 0.61: ATMEGA32U2.15 48.35,13.43 52.07,17.14 v52.07,22.48 | v92.34,23.5 94.14,24.77 U$6.13 | U$2.13 18.64,22.45 v18.71,22.48 | U$3.13 v37.13,22.48 | U$4.13 v56.14,22.48 | U$5.13 v75.4,22.48
  Bottom 0.61: v18.71,22.48 v37.13,22.48 v52.07,22.48 v56.14,22.48 v75.4,22.48 86.36,22.48 87.63,23.5 v92.34,23.5
ENABLE
  Top 0.61: ATMEGA32U2.10 42.88,9.43 42.88,4.45 44.45,3.17 LCD_SOCKET.6
GND  (via drill 0.6, 0.6 pad 0.61, 0.6 pad 1.02)
  Top 0.406: 36.27,7.21 ATMEGA32U2.3 36.2,7.07
  Top 0.61: LCD_SOCKET.12 29.21,3.81 v36.09,4.98 36.27,5.15 ATMEGA32U2.3 | ATMEGA32U2.28 35.16,11.83 36.27,10.79 36.27,7.21 | v85.7,18.15 85.7,20.7 v85.72,25.4 | JP26.2 24.64,43.18 22.45,40.99 U$2.1 | U$3.1 40.95,40.69 43.43,43.18 JP19.2 | U$4.1 59.95,40.4 62.74,43.18 JP12.2 | U$4.9 51.06,35.56 57.41,35.56 | 57.41,35.56 JP13.2 | U$4.14 57.41,35.56 | U$3.14 38.41,35.56 | 38.41,35.56 JP20.2 | U$3.9 32.05,35.56 38.41,35.56 | U$2.9 13.55,35.56 19.91,35.56 | 19.91,35.56 JP27.2 | U$2.14 19.91,35.56 | U$5.9 70.32,35.56 76.67,35.56 | 76.67,35.56 JP6.2 | U$5.14 76.67,35.56 | U$6.14 95.41,35.56 | 95.41,35.56 97.9,35.56 97.9,39.07 U$6.1 | U$6.9 89.06,35.56 | 89.06,35.56 95.41,35.56 | v88.9,35.56 89.06,35.56 | U$5.1 79.21,40.09 81.53,43.18 JP5.2 | JP38.5 JP38.4 JP38.3 JP38.2 JP38.1
  Top 0.813: C41.- U$1.IN
  Top 1.016: JP22.2 v20.95,73.66 | v40.01,73.66 JP15.2 | v77.47,73.66 JP1.2 | v59.05,73.66 JP8.2
  Bottom 0.406: 6.35,65.91 JP30.2 | 25.4,27.81 JP28.2 | HWB.1 49.53,8.26 | 85.5,15.5 R3.1
  Bottom 0.61: 52.48,9.53 59.05,9.53 59.19,9.39 C42.2 | 49.53,8.26 48.9,9.53 43.81,9.53 42.55,7.62 36.75,7.62 ATMEGA32U2.3 36.27,5.79 v36.09,4.98 | v85.7,18.15 R3.1 | R5.1 52.48,9.53 | HWB.1 52.48,9.53 | 9,14.31 9.16,14.47 12,17.31 12,23 4,23 2.03,21.03 JP38.1 | 29.02,2.35 LCD_SOCKET.12
  Bottom 0.813: C42.2 59.15,4.45 LCD_SOCKET.1 | C43.1 C44.1 | JP36.GND 76.2,5.71 C41.- | 86.36,9.93 C48.2 85.59,9.79 84.19,9.79 81.92,9.53 U$1.IN | 86.36,9.93 86.5,9.93 88.9,9.79 88.9,2.17 85.86,2.17 C47.2 | v85.72,25.4 85.72,27.81 | C46.2 9.16,14.47 12,17.68 12,23 12,25.5 13.34,27.3 | R3.1 85.72,11.56 86.36,9.93 | 44.45,65.91 JP16.2 | 9,14.31 9,8.5 11.79,5.71 C43.1 | C43.1 14.29,5.71 16,4 20,4 21.65,2.35 29.02,2.35
  Bottom 1.016: C2.2 82.55,65.91 JP2.2 88.9,66.04 | JP7.2 82.55,27.81 | C7.2 85.72,27.81 JP7.2 | C8.2 67.31,73.66 | 64.14,66.04 JP9.2 63.5,65.91 C9.2 69.22,65.91 | C10.2 67.31,58.42 | 67.31,58.42 JP10.2 | C11.2 67.31,50.8 | 67.31,50.8 JP11.2 | C12.2 67.94,43.18 | 67.94,43.18 JP12.2 | C13.2 67.94,35.56 | 67.94,35.56 JP13.2 | 86.36,73.66 JP1.2 82.55,73.53 C1.2 86.36,73.66 | C18.2 48.9,50.8 | 48.9,50.8 JP18.2 | JP17.2 48.9,58.42 C17.2 50.16,58.42 | JP15.2 49.53,73.66 C15.2 47.62,73.66 | C24.2 25.4,58.29 JP24.2 31.75,58.42 | C25.2 25.4,50.67 JP25.2 31.75,50.8 | C26.2 29.84,43.18 JP26.2 31.75,43.18 | C27.2 29.84,35.56 | 29.84,35.56 JP27.2 | C28.2 29.84,27.94 | 29.84,27.94 JP28.2 | C29.2 10.16,73.66 | 10.16,73.66 JP29.2 | C30.2 10.16,66.04 | 10.16,66.04 JP30.2 | JP31.2 10.16,58.42 C31.2 9.53,58.42 12.7,58.42 | JP32.2 10.16,50.8 C32.2 9.53,50.8 12.7,50.8 | C33.2 10.16,43.18 | 10.16,43.18 JP33.2 | C34.2 10.16,35.56 | 10.16,35.56 JP34.2 | C35.2 10.16,27.94 | 10.16,27.94 JP35.2 | 12.06,73.66 12.06,66.04 | 12.06,66.04 10.16,66.04 | 12.7,58.42 12.06,66.04 | 12.7,50.8 12.7,58.42 | 10.16,43.18 12.7,43.18 | 12.7,43.18 12.7,50.8 | 10.16,35.56 12.7,35.56 | 12.7,35.56 12.7,43.18 | 12.7,27.94 12.7,35.56 | JP22.2 28.57,73.66 C22.2 31.75,73.66 | JP23.2 25.4,65.91 C23.2 31.75,65.91 | 31.75,73.66 31.75,65.91 | 31.75,58.42 31.75,65.91 | 31.75,50.8 31.75,58.42 | 31.75,43.18 31.75,50.8 | 29.84,35.56 31.75,35.56 | 31.75,35.56 31.75,43.18 | 29.84,27.94 31.75,27.94 | 69.22,73.66 69.22,65.91 | 67.31,58.42 69.22,58.42 | 69.22,58.42 69.22,65.91 | 67.31,50.8 69.22,50.8 | 69.22,50.8 69.22,58.42 | 67.94,43.18 69.22,43.18 | 69.22,43.18 69.22,50.8 | 67.94,35.56 69.22,35.56 | 69.22,35.56 69.22,43.18 | 69.22,35.56 69.22,27.94 67.94,27.94 C39.2 75.56,24.77 80.01,24.77 80.01,26.67 JP7.2
  Bottom 1.016: 12.06,73.66 v20.95,73.66 | 12.06,73.66 10.16,73.66 | 31.75,73.66 v40.01,73.66 | 69.22,73.66 v77.47,73.66 | JP8.2 67.31,73.66 | 69.22,73.66 67.31,73.66 | 88.9,66.04 88.9,73.66 86.36,73.66 | JP3.2 86.36,58.42 | 88.9,58.42 88.9,66.04 | JP4.2 86.36,50.8 C4.2 88.9,50.03 | 88.9,50.03 88.9,58.42 | 88.9,58.42 86.36,58.42 | 86.36,58.42 C3.2 | JP5.2 88.9,43.18 | 88.9,43.18 88.9,50.03 | JP6.2 v88.9,35.56 | v88.9,35.56 88.9,43.05 | C5.2 88.9,43.05 | 88.9,43.05 88.9,43.18 | C6.2 88.9,35.43 | 88.9,35.43 v88.9,35.56 | 88.9,27.94 88.9,27.81 JP7.2 | 88.9,27.94 88.9,35.43 | 31.75,35.56 31.75,27.94 | 12.7,27.94 10.16,27.94 | 50.16,58.42 50.16,73.66 v59.05,73.66 | 48.9,50.8 50.16,50.8 | 50.16,50.8 50.16,58.42 | 50.16,43.18 C19.2 44.45,43.05 JP19.2 | 50.16,43.18 50.16,50.8 | 50.16,27.94 50.16,35.56 | 31.75,27.94 33.02,27.3 C37.2 36.83,24.77 41.91,24.77 41.91,26.04 JP21.2 C21.2 50.16,27.94 | 50.16,27.94 C38.2 55.88,24.77 60.33,24.77 60.33,26.67 JP14.2 C14.2 | C40.2 88.9,27.94 | C36.2 13.34,27.3 12.7,27.94 | 50.16,35.56 48.26,35.56 48.26,35.43 C20.2 44.45,35.43 JP20.2 | 50.16,35.56 50.16,43.18 | 44.45,65.91 C16.2
  pour Bottom (isolate 1.016): -0.23,79.49 99.56,79.74 99.06,0.27 0.27,0.02
HWB
  Top 0.61: ATMEGA32U2.13 44.69,11.83 46.99,9.53 | 46.99,9.53 HWB.2 | R7.1 53.17,9.53 46.99,9.53
MISO  (via drill 0.6 pad 1.02)
  Top 0.61: v89.53,22.48 89.53,23.5 92.86,25.4 U$6.12 | v49.53,21.45 49.53,18.29 47.62,15.72 ATMEGA32U2.17 | U$2.12 17.36,21.18 v17.34,21.45 | U$3.12 v35.87,21.45 | U$4.12 v54.87,21.45 | U$5.12 v74.13,21.45
  Bottom 0.61: v17.34,21.45 v35.87,21.45 v49.53,21.45 v54.87,21.45 v74.13,21.45 87.25,21.45 88.9,22.48 v89.53,22.48
MOSI  (via drill 0.6 pad 1.02)
  Top 0.61: ATMEGA32U2.16 47.88,14.23 50.8,17.78 v50.8,20.43 | v88.27,20.43 88.27,24.13 91.59,26.04 U$6.11 | U$3.11 v34.59,20.43 | U$4.11 v53.6,20.43 | U$5.11 v72.86,20.43 | U$2.11 16.09,20.93 16.09,20.69 v16.13,20.43
  Bottom 0.61: v88.27,20.43 v72.86,20.43 v53.6,20.43 v50.8,20.43 v34.59,20.43 v16.13,20.43
N$1  (via drill 0.6 pad 1.02)
  Top 0.61: v39,10.5 38,9 ATMEGA32U2.5
  Bottom 0.61: LED1.A 91.39,19.4 63,19.4 58,16 58,12 54,12 51,10.5 v39,10.5
N$2
  Top 0.61: JP15.1 47.75,71.12 49.78,69.09 49.78,65.79 58.67,56.9 58.67,39.08 U$4.2
N$3
  Top 0.61: U$4.3 57.41,55.62 49.53,63.5 JP16.1
N$4
  Top 0.61: U$4.4 56.14,49.77 50.04,55.88 JP17.1
N$5
  Top 0.61: U$4.5 54.87,44.19 50.8,48.26 JP18.1
N$6
  Top 0.61: U$4.6 53.6,43.18 46.74,43.18 46.74,40.64 JP19.1
N$7  (via drill 0.6 pad 1.02)
  Top 0.61: ATMEGA32U2.30 31.23,10.23 v29.8,10.7
  Bottom 0.61: R1.2 53.84,15.84 50,12.5 29.8,12.5 v29.8,10.7
N$8
  Top 0.61: C44.2 20.95,2.54 Q1.1 25.13,5.71 35.29,5.71 35.47,6.25 ATMEGA32U2.2
N$9
  Top 0.61: C43.2 19.05,5.71 Q1.2 22.86,9.14 25,7 34.53,7 ATMEGA32U2.1
N$11
  Top 0.61: JP20.1 46.99,33.02 48.01,34.04 48.01,41.91 52.32,41.91 52.32,39.62 52.33,39.62 U$4.7
N$12
  Top 0.61: JP21.1 46.99,25.4 49.28,27.69 49.28,40.64 51.06,40.64 U$4.8
N$13
  Top 0.61: JP1.1 85.85,71.12 88.39,68.58 88.39,63.75 88.65,63.5 88.9,63.25 96.67,55.47 U$6.2
N$14  (via drill 0.6 pad 1.02)
  Top 0.61: ATMEGA32U2.29 31.47,11.03 v31,11.5
  Bottom 0.61: v31,11.5 50.5,11.5 R2.2
N$15
  Bottom 0.61: R2.1 65,10.61 65,7.5 66.78,5.71 JP36.D+
N$16
  Bottom 0.61: R1.1 67,12.06 67,8.5 67.8,7.7 JP36.D-
N$17
  Top 0.61: U$6.3 95.41,54.2 85.85,63.5 JP2.1
N$19
  Bottom 0.813: R3.2 LED1.K
N$20
  Top 0.61: ATMEGA32U2.26 30.82,13.43 30.25,14 7.96,14 JP37.1
N$22
  Top 0.61: ATMEGA32U2.25 31.77,14.23 31.25,14.8 6.49,14.8 JP37.2
N$24
  Top 0.61: LCD_SOCKET.3 60.33,10.79 R5.2
N$25
  Top 0.61: U$6.4 94.14,49.38 87.63,55.88 JP3.1
N$26
  Top 0.61: ATMEGA32U2.23 35.44,16.87 8,16.87 5.75,16.96 JP37.4
N$27
  Bottom 0.813: R6.2 14.4,8 19.5,8 21,6.5 29.5,6.5 LCD_SOCKET.11
N$28  (via drill 0.6 pad 1.02)
  Top 0.61: v18.46,12.13 18.96,12.63 ATMEGA32U2.27
  Bottom 0.61: C46.1 18.57,12.63 v18.46,12.13
N$29
  Top 0.61: U$6.5 92.86,45.06 89.92,48.26 JP4.1
N$30
  Top 0.61: JP5.1 85.09,40.64 85.09,43.69 91.59,43.69 U$6.6
N$32
  Top 0.61: U$3.7 33.33,41.91 29.21,41.91 29.21,34.29 27.94,33.02 JP27.1
N$33
  Top 0.61: JP28.1 28.45,25.4 30.48,27.43 30.48,40.64 32.05,40.64 U$3.8
N$34
  Top 0.61: U$2.8 13.55,40.64 11.68,40.64 11.68,28.45 8.64,25.4 JP35.1
N$35
  Top 0.61: U$2.7 14.82,42.16 10.41,42.16 10.41,34.8 8.64,33.02 JP34.1
N$36
  Top 0.61: JP6.1 85.09,33.02 86.36,34.54 86.36,42.16 90.33,42.16 U$6.7
N$38
  Top 0.61: JP7.1 83.82,25.4 85.34,26.92 85.34,31.24 87.88,33.78 87.88,40.64 89.06,40.64 U$6.8
N$39
  Top 0.61: ATMEGA32U2.14 48.83,12.63 53.84,17.14 87,17.14 87,24.77 90.33,26.67 U$6.10
N$40
  Top 0.61: ATMEGA32U2.21 37.08,16.91 37.03,18.55 15.5,18.55 14.82,19.93 U$2.10
N$41
  Top 0.61: JP14.1 67.06,25.4 68.58,26.92 68.58,40.39 70.32,40.39 U$5.8
N$42
  Top 0.61: U$5.7 71.59,41.66 67.31,41.66 67.31,34.29 66.04,33.02 JP13.1
N$43
  Top 0.61: U$5.6 72.86,43.18 66.04,43.18 66.04,40.64 JP12.1
N$44
  Top 0.61: ATMEGA32U2.20 37.87,19.42 33.35,19.42 33.35,32.9 U$3.10
N$45
  Top 0.61: JP11.1 70.1,48.26 74.17,44.2 74.17,39.11 U$5.5
N$46
  Top 0.61: U$5.4 75.4,46.19 75.44,46.48 75.44,49.78 68.58,55.88 JP10.1
N$47  (via drill 0.6 pad 1.02)
  Top 0.61: v53.34,18.41 71.59,18.41 U$5.10 | ATMEGA32U2.18 39.47,17.24 41.28,18.41 v47.62,18.41
  Bottom 0.61: v47.62,18.41 v53.34,18.41
N$48
  Top 0.61: ATMEGA32U2.19 38.66,18.41 52.33,25.4 U$4.10
N$50
  Top 0.61: JP9.1 67.31,63.5 76.67,54.91 U$5.3
N$51
  Top 0.61: U$5.2 77.94,56.68 69.09,64.52 69.09,69.09 67.06,71.12 JP8.1
N$52
  Top 0.61: U$3.5 35.87,44.15 31.75,48.26 JP25.1
N$54
  Top 0.61: U$3.4 37.13,51.77 33.02,55.88 JP24.1
N$55
  Top 0.61: U$3.3 38.41,55.58 30.48,63.5 JP23.1
N$58
  pour Top (isolate 1.016): -0.23,79.49 99.56,79.74 99.06,0.27 0.27,0.02
N$59
  Top 0.61: ATMEGA32U2.22 36.27,16.73 36,17.75 9.5,17.75 6.5,17.94 JP37.5
N$60
  Top 0.61: U$3.2 39.67,56.84 39.62,56.9 39.62,57.66 31.5,65.79 31.5,69.34 29.72,71.12 JP22.1
N$61
  Top 0.61: U$2.6 16.09,43.43 9.14,43.43 9.14,40.64 JP33.1
N$62
  Top 0.61: JP32.1 6.37,48.24 15.14,48.24 17.36,46.02 U$2.5
N$63
  Top 0.61: U$2.4 18.64,52.59 15.35,55.87 JP31.1
N$64
  Top 0.61: U$2.3 19.91,55.69 12.15,63.61 6.46,63.61 JP30.1
N$65
  Top 0.61: JP29.1 9.88,71.12 12,69 12,66.06 20.16,57.9 20.5,57.56 21.18,56.89 U$2.2
N$66
  Top 0.61: JP26.1 25.4,40.89 27.94,40.89 27.94,43.18 34.59,43.18 U$3.6
RESET
  Top 0.61: ATMEGA32U2.24 32.44,15.72 5.99,15.75 JP37.3
  Bottom 0.813: R4.1 7.31,15.19 JP37.3
RS
  Top 0.61: ATMEGA32U2.12 41.79,11 44.1,11 45,9.7 45,6.1 45.3,5.8 48.4,5.8 49.53,4.97 LCD_SOCKET.4
RW
  Top 0.61: ATMEGA32U2.11 43.18,10.23 43.81,9.6 43.81,5.08 44.45,4.45 45.72,4.45 46.99,3.17 LCD_SOCKET.5

### Text on the board
tNames: Peacock III (ver.0.2) / by C.Miyama